# Altium schematic sheet POWER.SchDoc
size A4; SheetNumber: 1; SheetTotal: 5
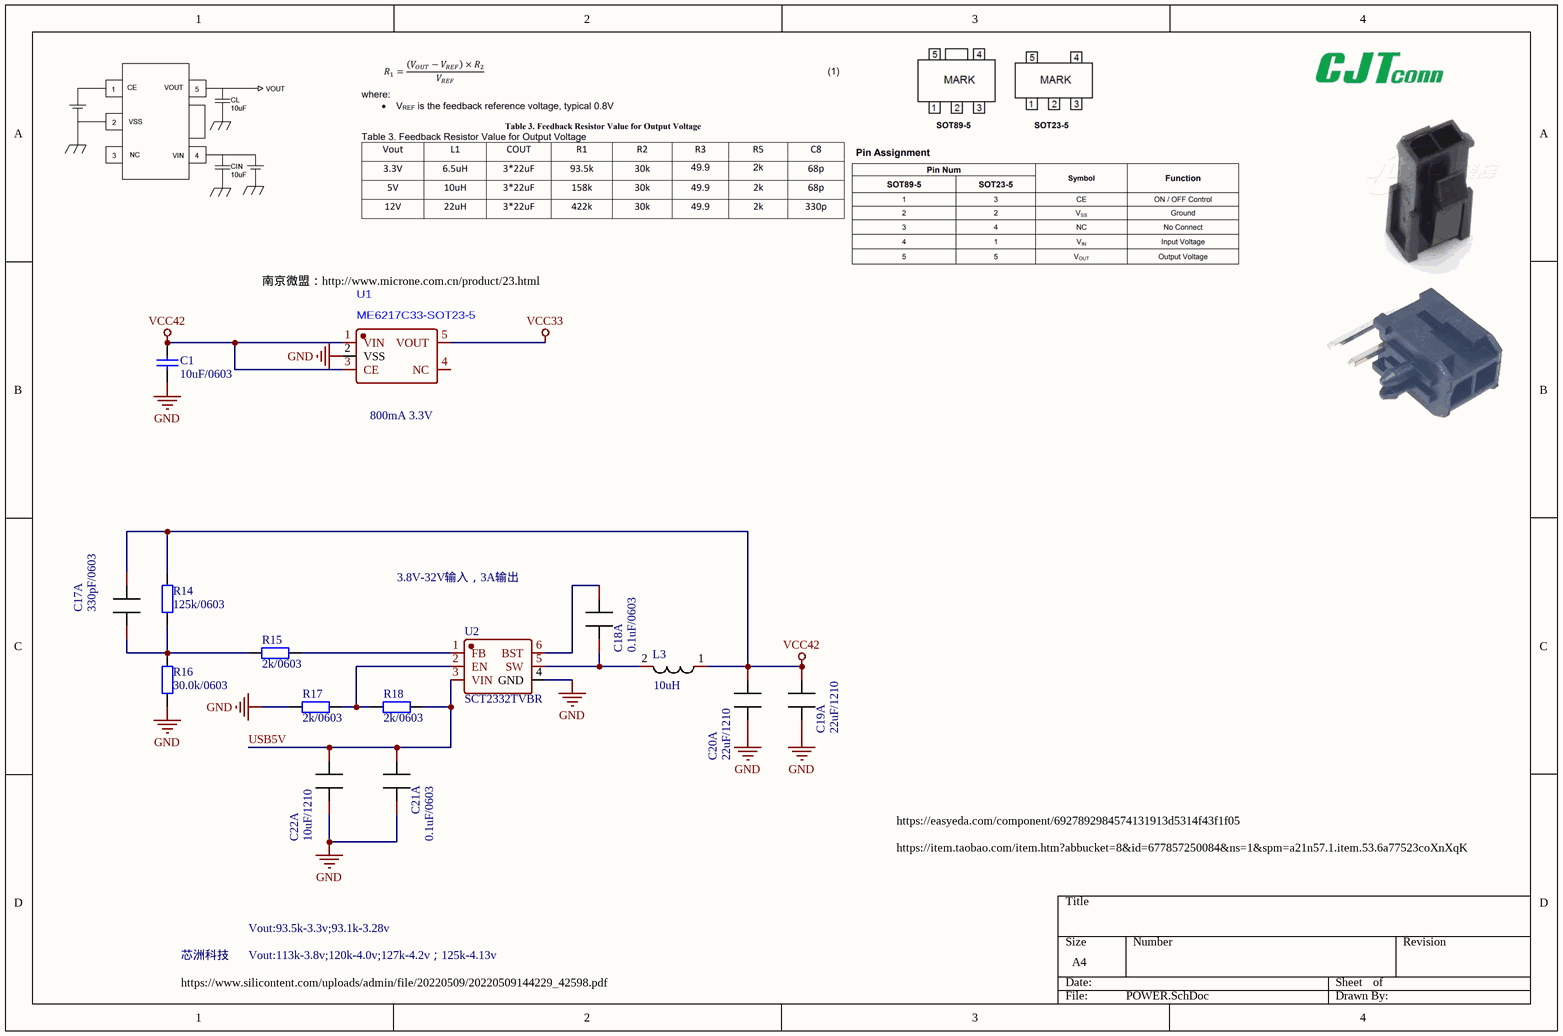
[diagram p0: POWER.SchDoc]

## Parts
C1  10uF/0603  [CAP0603]
C17  330pF/0603  [CAP0603]  (part A of 4)
C18  0.1uF/0603  [CAP0603]  (part A of 4)
C19  22uF/1210  [CAP0603]  (part A of 4)
C20  22uF/1210  [CAP1210-CAPC3225X140N]  (part A of 4)
C21  0.1uF/0603  [CAP0603]  (part A of 4)
C22  10uF/1210  [CAP1210-CAPC3225X140N]  (part A of 4)
L3  10uH  [IND-SMD_L4.7-W4.7-6.5uH]
R14  125k/0603  [RES0603]
R15  2k/0603  [RES0603]
R16  30.0k/0603  [RES0603]
R17  2k/0603  [RES0603]
R18  2k/0603  [RES0603]
U1  ME6217C33-SOT23-5  [ME6217C33-SOT23-5]
U2  SCT2332TVBR  [SCT2332TVBR-TSOT23-6]

## Nets
GND: C1.1 C19.2 C20.2 C21.2 C22.2 R16.2 R17.2 U1.2(VSS) U2.4(GND)
VCC33: U1.5(VOUT)
VCC42: C1.2 C17.1 C19.1 C20.1 L3.1 R14.1 U1.1(VIN) U1.3(CE)
USB5V: C21.1 C22.1 R18.1 U2.3(VIN)
NetC17_2: C17.2 R14.2 R15.2 R16.1
NetC18_1: C18.1 U2.6(BST)
NetC18_2: C18.2 L3.2 U2.5(SW)
NetR15_1: R15.1 U2.1(FB)
NetR17_1: R17.1 R18.2 U2.2(EN)

Not connected (* = marked no-connect by the designer): U1 4(NC)

## Notes on the sheet
- 南京微盟：http://www.microne.com.cn/product/23.html
- (near U1) 800mA 3.3V
- 3.8V-32V输入，3A输出
- https://item.taobao.com/item.htm?abbucket=8&id=677857250084&ns=1&spm=a21n57.1.item.53.6a77523coXnXqK
- https://easyeda.com/component/6927892984574131913d5314f43f1f05
- 芯洲科技
- https://www.silicontent.com/uploads/admin/file/20220509/20220509144229_42598.pdf
- Vout:113k-3.8v;120k-4.0v;127k-4.2v；125k-4.13v
- Vout:93.5k-3.3v;93.1k-3.28v

## Library data of the parts
C1 = Cap Semi: Capacitor (Semiconductor SIM Model); Value: 10uf; Published: 8-Jun-2000; LatestRevisionDate: 29-May-2009; LatestRevisionNote: IPC-7351 Footprint Added.; PackageReference: C1206; Publisher: Altium Limited; PackageDescription: Chip Capacitor
C17 = CAP0603: SURFACE MOUNT CAPACITOR 0.031 X 0.061 INCHES; Manufacturer #1: IPC SM-782 STD.; Sim_Analog_Order: Model$; Value: 330pF/0603/25V; PCB DECAL: 0603; Add into BOM: yes; Name: CAP0603; Symbol: CAP0603; Device: CAP0603; OldName: CAP0603; Convert to PCB: yes; Origin Footprint: 0603
C18 C19 C21 = CAP0603: SURFACE MOUNT CAPACITOR 0.031 X 0.061 INCHES; Manufacturer #1: IPC SM-782 STD.; Sim_Analog_Order: Model$; Value: 0.1uF/0603/50V; PCB DECAL: 0603; Add into BOM: yes; Name: CAP0603; Symbol: CAP0603; Device: CAP0603; OldName: CAP0603; Convert to PCB: yes; Origin Footprint: 0603
C20 = CAP0603: SURFACE MOUNT CAPACITOR 0.031 X 0.061 INCHES; Manufacturer #1: IPC SM-782 STD.; Sim_Analog_Order: Model$; Value: 22uF/1210/35V; PCB DECAL: 0603; Add into BOM: yes; Name: CAP0603; Symbol: CAP0603; Device: CAP0603; OldName: CAP0603; Convert to PCB: yes; Origin Footprint: 0603
C22 = CAP0603: SURFACE MOUNT CAPACITOR 0.031 X 0.061 INCHES; Manufacturer #1: IPC SM-782 STD.; Sim_Analog_Order: Model$; Value: 10uF/1210/35V; PCB DECAL: 0603; Add into BOM: yes; Name: CAP0603; Symbol: CAP0603; Device: CAP0603; OldName: CAP0603; Convert to PCB: yes; Origin Footprint: 0603
L3 = IND-MOLDED: 0503贴片电感; Sim_Analog_Order: Model$; Sim_Analog_Prefix: L; Description" MOLDED INDUCTOR, 0_5: PIN SPACING; PCB DECAL: L_0650; Add into BOM: yes; Name: IND-MOLDED; Symbol: IND-MOLDED; Device: IND-MOLDED; OldName: IND-MOLDED; Value: 10uH; Convert to PCB: yes; Origin Footprint: L_0650
R14-R18 = Res2: Resistor; Published: 8-Jun-2000; LatestRevisionDate: 17-Jul-2002; LatestRevisionNote: Re-released for DXP Platform.; PackageReference: AXIAL-0.4; Publisher: Altium Limited; PackageDescription: Axial Device, Thru-Hole; 2 Leads; 0.4 in Pin Spacing
U1 = ME6217C33M5G: 4.2v-3.3v LDO
U2 = SCT2332TVBR: 3.8V-32V Vin, 3A Synchronous Step-down DCDC Converter